# Altium schematic sheet NIR-Spec-Analog-SCH_SH2_(01).SchDoc: SCHEMATIC
size 863 x 558 mm; DocumentNumber: NIR-Spec-2; SheetNumber: 2; SheetTotal: 3; PageSetup: Record=PageOptions|CenterHorizontal=True|CenterVertical=True|PrintScale=0.98|XCorrection=1.00|YCorrection=1.00|PrintKind=2|BorderSize=5000000|LeftOffset=0|BottomOffset=0|Orientation=2|PaperLength=1000|PaperWidth=1000|Scale=100|PaperSource=15|PrintQuality=1200|MediaType=1|DitherType=10|PaperKind=11 x 17|PrintScaleMode=1
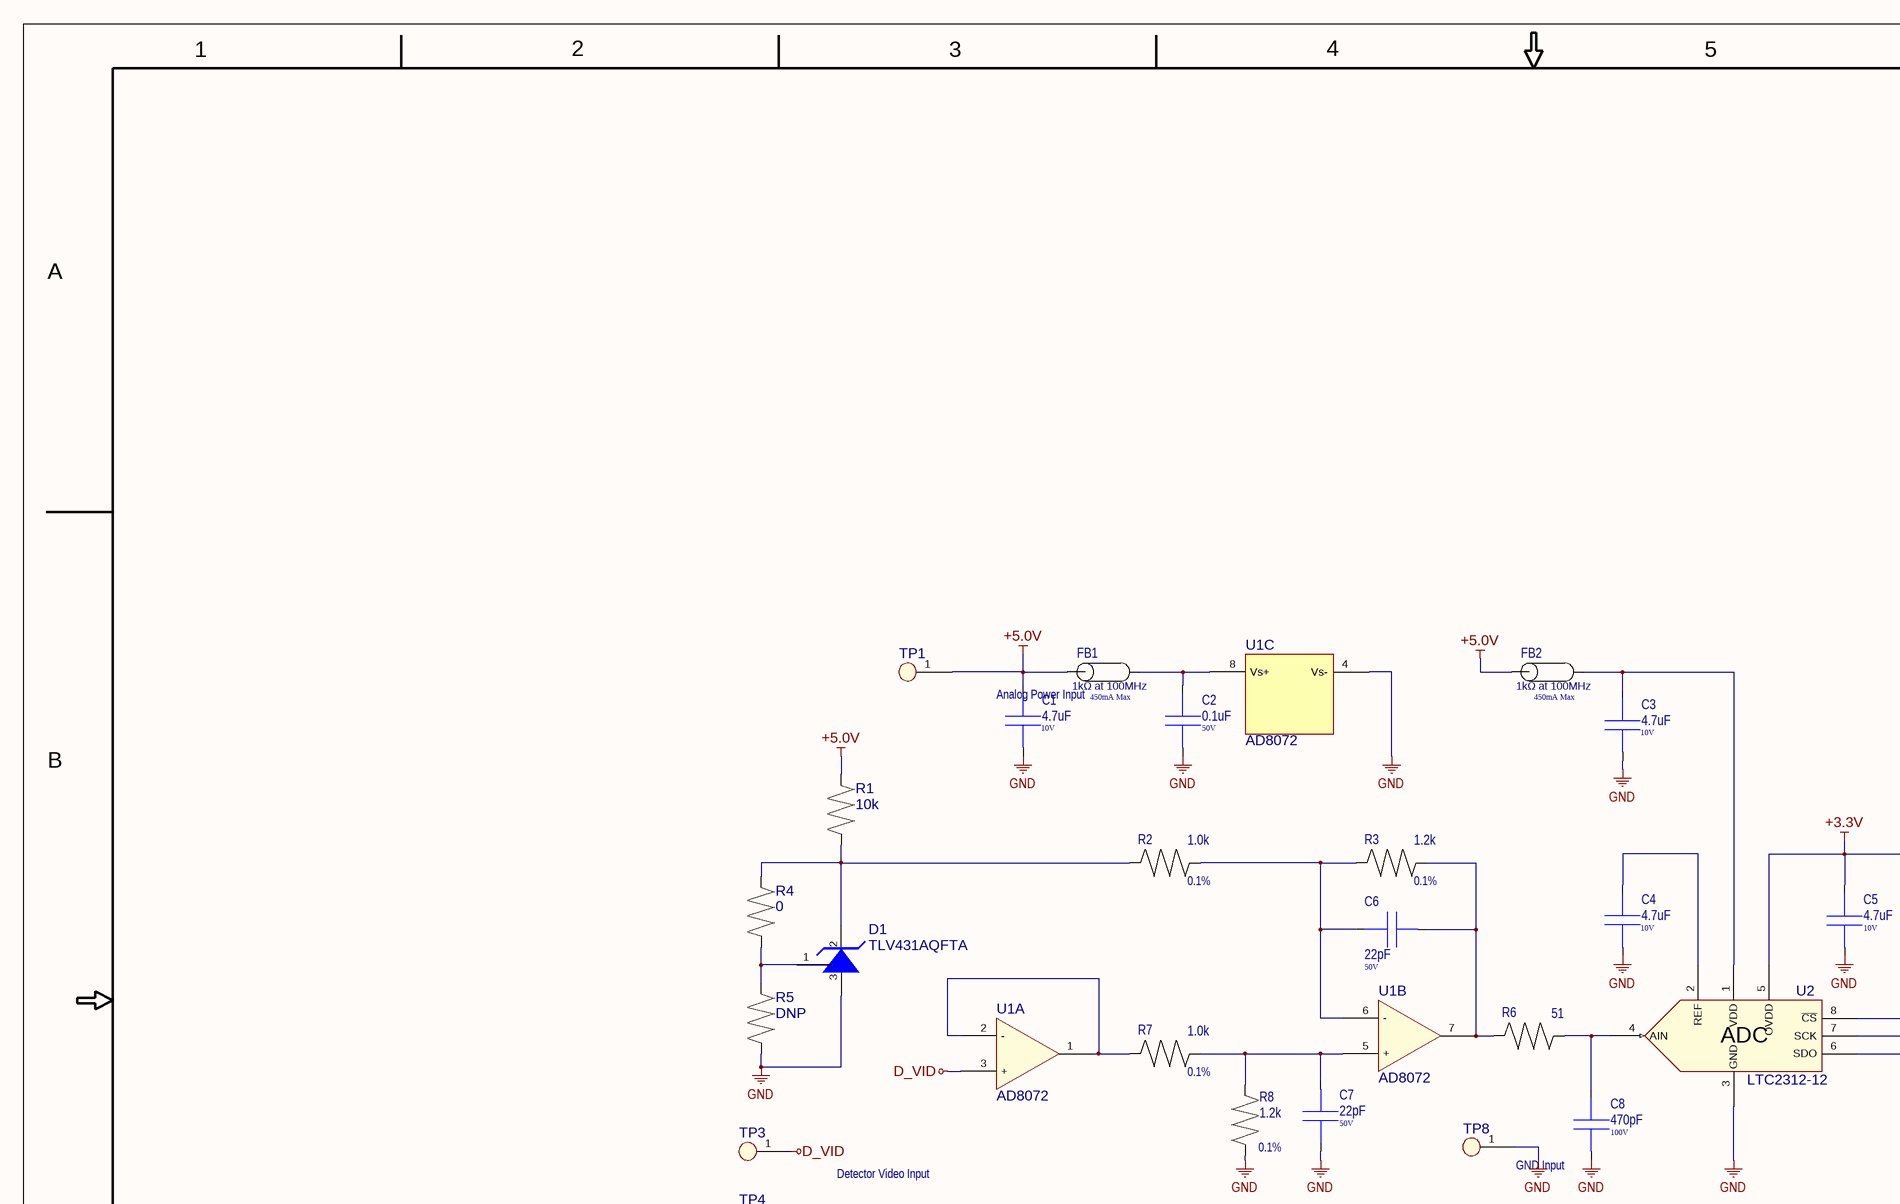
[diagram p0: NIR-Spec-Analog-SCH_SH2_(01).SchDoc, top left]
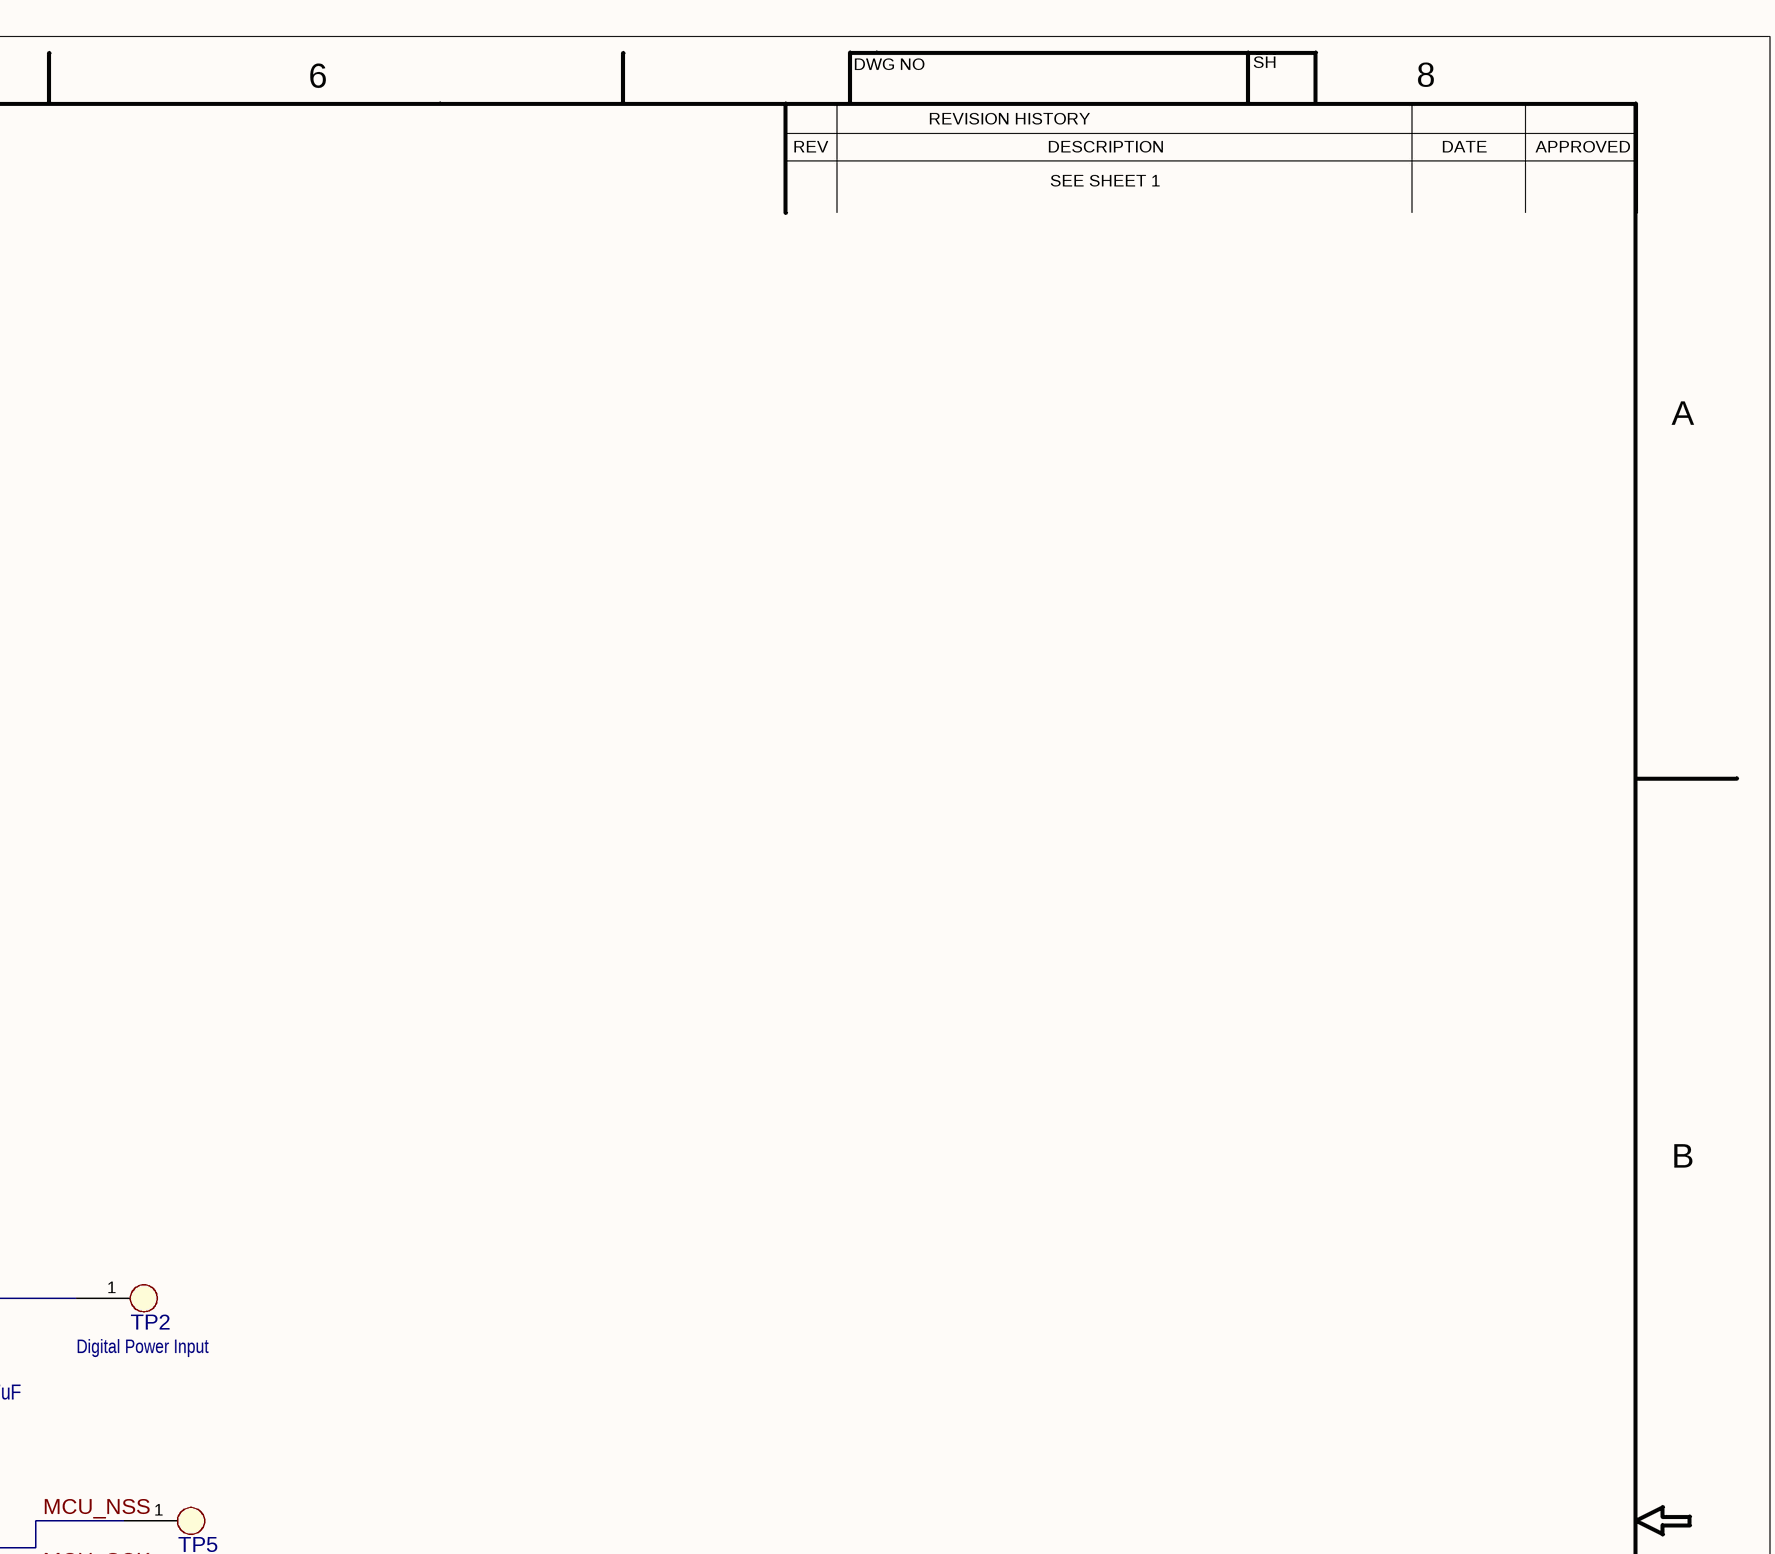
[diagram p1: NIR-Spec-Analog-SCH_SH2_(01).SchDoc, top right]
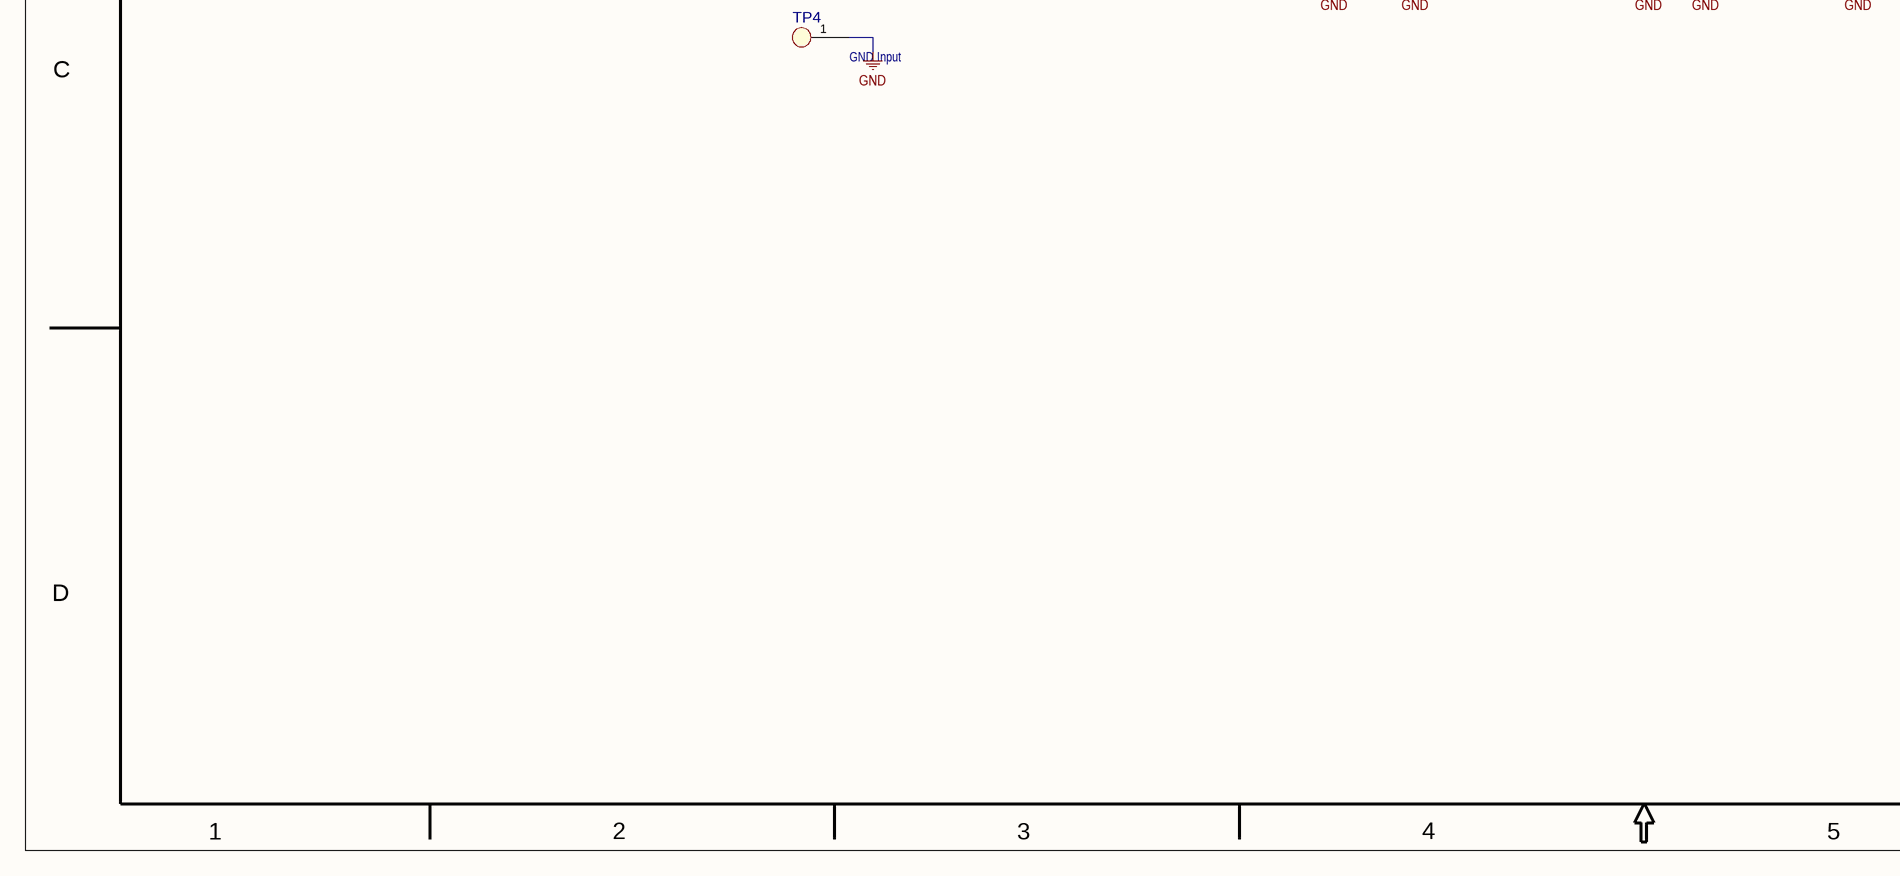
[diagram p2: NIR-Spec-Analog-SCH_SH2_(01).SchDoc, bottom left]
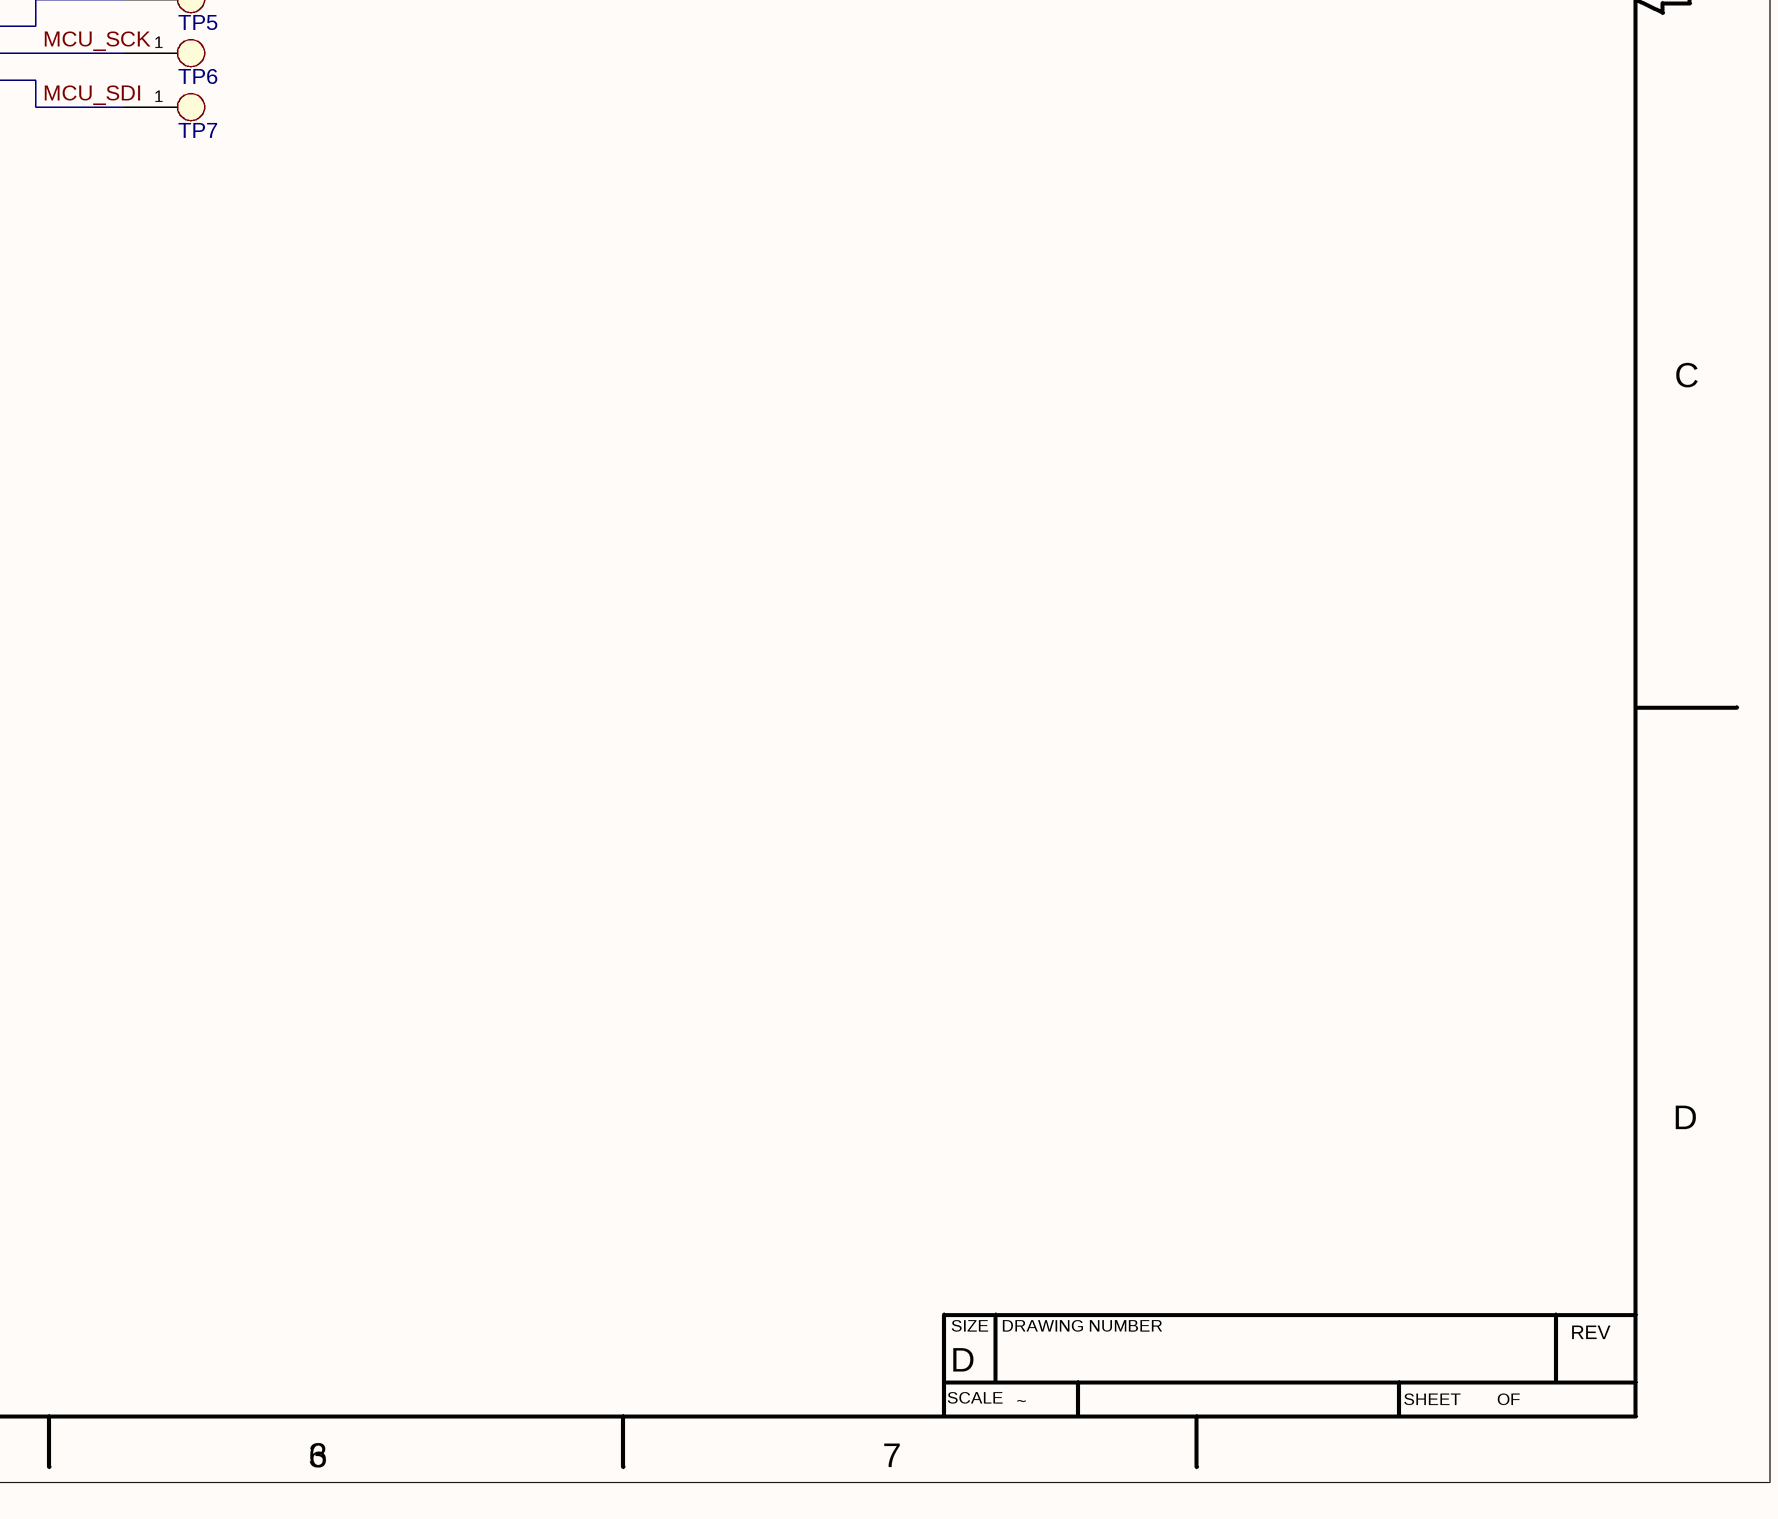
[diagram p3: NIR-Spec-Analog-SCH_SH2_(01).SchDoc, bottom right]

## Parts
C1  4.7uF  Voltage: 10V  [0402]
C2  0.1uF  Voltage: 50V  [0402]
C3  4.7uF  Voltage: 10V  [0402]
C4  4.7uF  Voltage: 10V  [0402]
C5  4.7uF  Voltage: 10V  [0402]
C6  22pF  Voltage: 50V  [0402]
C7  22pF  Voltage: 50V  [0402]
C8  470pF  Voltage: 100V  [0402]
D1  TLV431AQFTA  [SOT-23-3]
FB1  Rated Current: 450mA Max  Impedance: 1kΩ at 100MHz  [0402]  (hidden comment: Ferrite_Bead)
FB2  Rated Current: 450mA Max  Impedance: 1kΩ at 100MHz  [0402]  (hidden comment: Ferrite_Bead)
R1  10k  [0402]
R2  1.0k  [0402]
R3  1.2k  [0402]
R4  0  [0603]
R5  DNP  [0603]
R6  51  [0402]
R7  1.0k  [0402]
R8  1.2k  [0402]
TP1  TEST POINT  [30x40 TP]  (value not drawn)
TP2  TEST POINT  [30x40 TP]  (value not drawn)
TP3  TEST POINT  [30x40 TP]  (value not drawn)
TP4  TEST POINT  [30x40 TP]  (value not drawn)
TP5  TEST POINT  [30x40 TP]  (value not drawn)
TP6  TEST POINT  [30x40 TP]  (value not drawn)
TP7  TEST POINT  [30x40 TP]  (value not drawn)
TP8  TEST POINT  [30x40 TP]  (value not drawn)
U1  AD8072  [SOIC_8]  (parts A,B,C of 3)
U2  LTC2312-12  [TSOT-23-8]

## Nets
+3.3V: C5.2 TP2.1 U2.5(OVDD)
+5.0V: C1.2 FB1.1 FB2.1 R1.1 TP1.1
D_VID: TP3.1 U1.3(+)
GND: C1.1 C2.1 C3.1 C4.1 C5.1 C7.2 C8.1 D1.3(A) R5.2 R8.1 TP4.1 TP8.1 U1.4(Vs-) U2.3(GND)
MCU_NSS: TP5.1 U2.8(~{CS})
MCU_SCK: TP6.1 U2.7(SCK)
MCU_SDI: TP7.1 U2.6(SDO)
NetC2_2: C2.2 FB1.2 U1.8(Vs+)
NetC3_2: C3.2 FB2.2 U2.1(VDD)
NetC4_2: C4.2 U2.2(REF)
NetC6_1: C6.1 R3.2 R6.1 U1.7(OUT)
NetC6_2: C6.2 R2.2 R3.1 U1.6(-)
NetC7_1: C7.1 R7.2 R8.2 U1.5(+)
NetC8_2: C8.2 R6.2 U2.4(AIN)
NetD1_1: D1.1(REF) R4.2 R5.1
NetD1_2: D1.2(K) R1.2 R2.1 R4.1
NetR7_1: R7.1 U1.1(OUT) U1.2(-)

## Notes on the sheet
- 1
- 2
- 3
- 4
- 5
- 6
- DWG NO
- REVISION HISTORY
- SH
- 8
- REV
- DESCRIPTION
- SEE SHEET 1
- DATE
- APPROVED
- A
- Analog Power Input
- B
- (near R2) 0.1%
- (near R3) 0.1%
- (near TP2) Digital Power Input
- (near R7) 0.1%
- (near TP3) Detector Video Input
- (near R8) 0.1%
- (near TP8) GND Input
- C
- (near TP4) GND Input
- D
- SIZE
- DRAWING NUMBER
- SCALE
- ~
- SHEET        OF
- 7
- (in symbol LTC2314xTS8-14#TRMPBF) ADC

## Library data of the parts
C1 C3-C5 = CAP: CAP CER 10UF 10V X6S 0603; Part Number: GRM188C81A106MA73D; Manufacturer: Murata Electronics
C2 = CAP: CAP CER 0.1UF 50V X7R 0603; Part Number: C0603C104K5RAC3121; Manufacturer: KEMET
C6 C7 = CAP: CAP CER 22PF NP0 50V 0603; Part Number: VJ0603A220KXAAC; Manufacturer: Vishay
C8 = CAP: CAP CER 470PF NP0 100V 0603; Part Number: VJ0603A220KXAAC; Manufacturer: Vishay
D1 = TLV431AQFTA: Shunt Voltage Reference IC Adjustable 1.24V 18 VV ±1% 15 mA SOT-23-3; Manufacturer: Diodes Incorporated; Part Number: TLV431AQFTA
FB1 FB2 = Ferrite_Bead: Ferrite Beads 1000 OHM 25%; Manufacturer: Murata Electronics; Part Number: BLM18AG102SH1D
R1 R4 R5 = RES: RESISTOR; Part Number: *; Manufacturer: *
R2 R7 = RES: Part Number: CPF-A-0603B1K0E; Manufacturer: TE Connectivity
R3 R8 = RES: Thin Film Resistors - SMD 0603 249ohms 25ppm 0.5%; Part Number: ERA-3AED2490V; Manufacturer: Panasonic
R6 = RES: Thin Film Resistors - SMD .1W 51ohm 1% 0603; Part Number: MCT06030C5109FP500; Manufacturer: Vishay
U1 = AD8072: IC OPAMP VIDEO DUAL 8MSOP; Part Number: AD8072ARMZ; Manufacturer: Analog Devices Inc.
U2 = LTC2314xTS8-14#TRMPBF: IC ADC 12BIT SAR TSOT23-8; Manufacturer: Linear Technology; Part Number: LTC2314xTS8-14#TRMPBF
TP1-TP8 = TEST POINT
  TP1: ClassName: Test Points